# EasyEDA Pro project bldc_board.eprj

# Schematic Dual_Drive_4
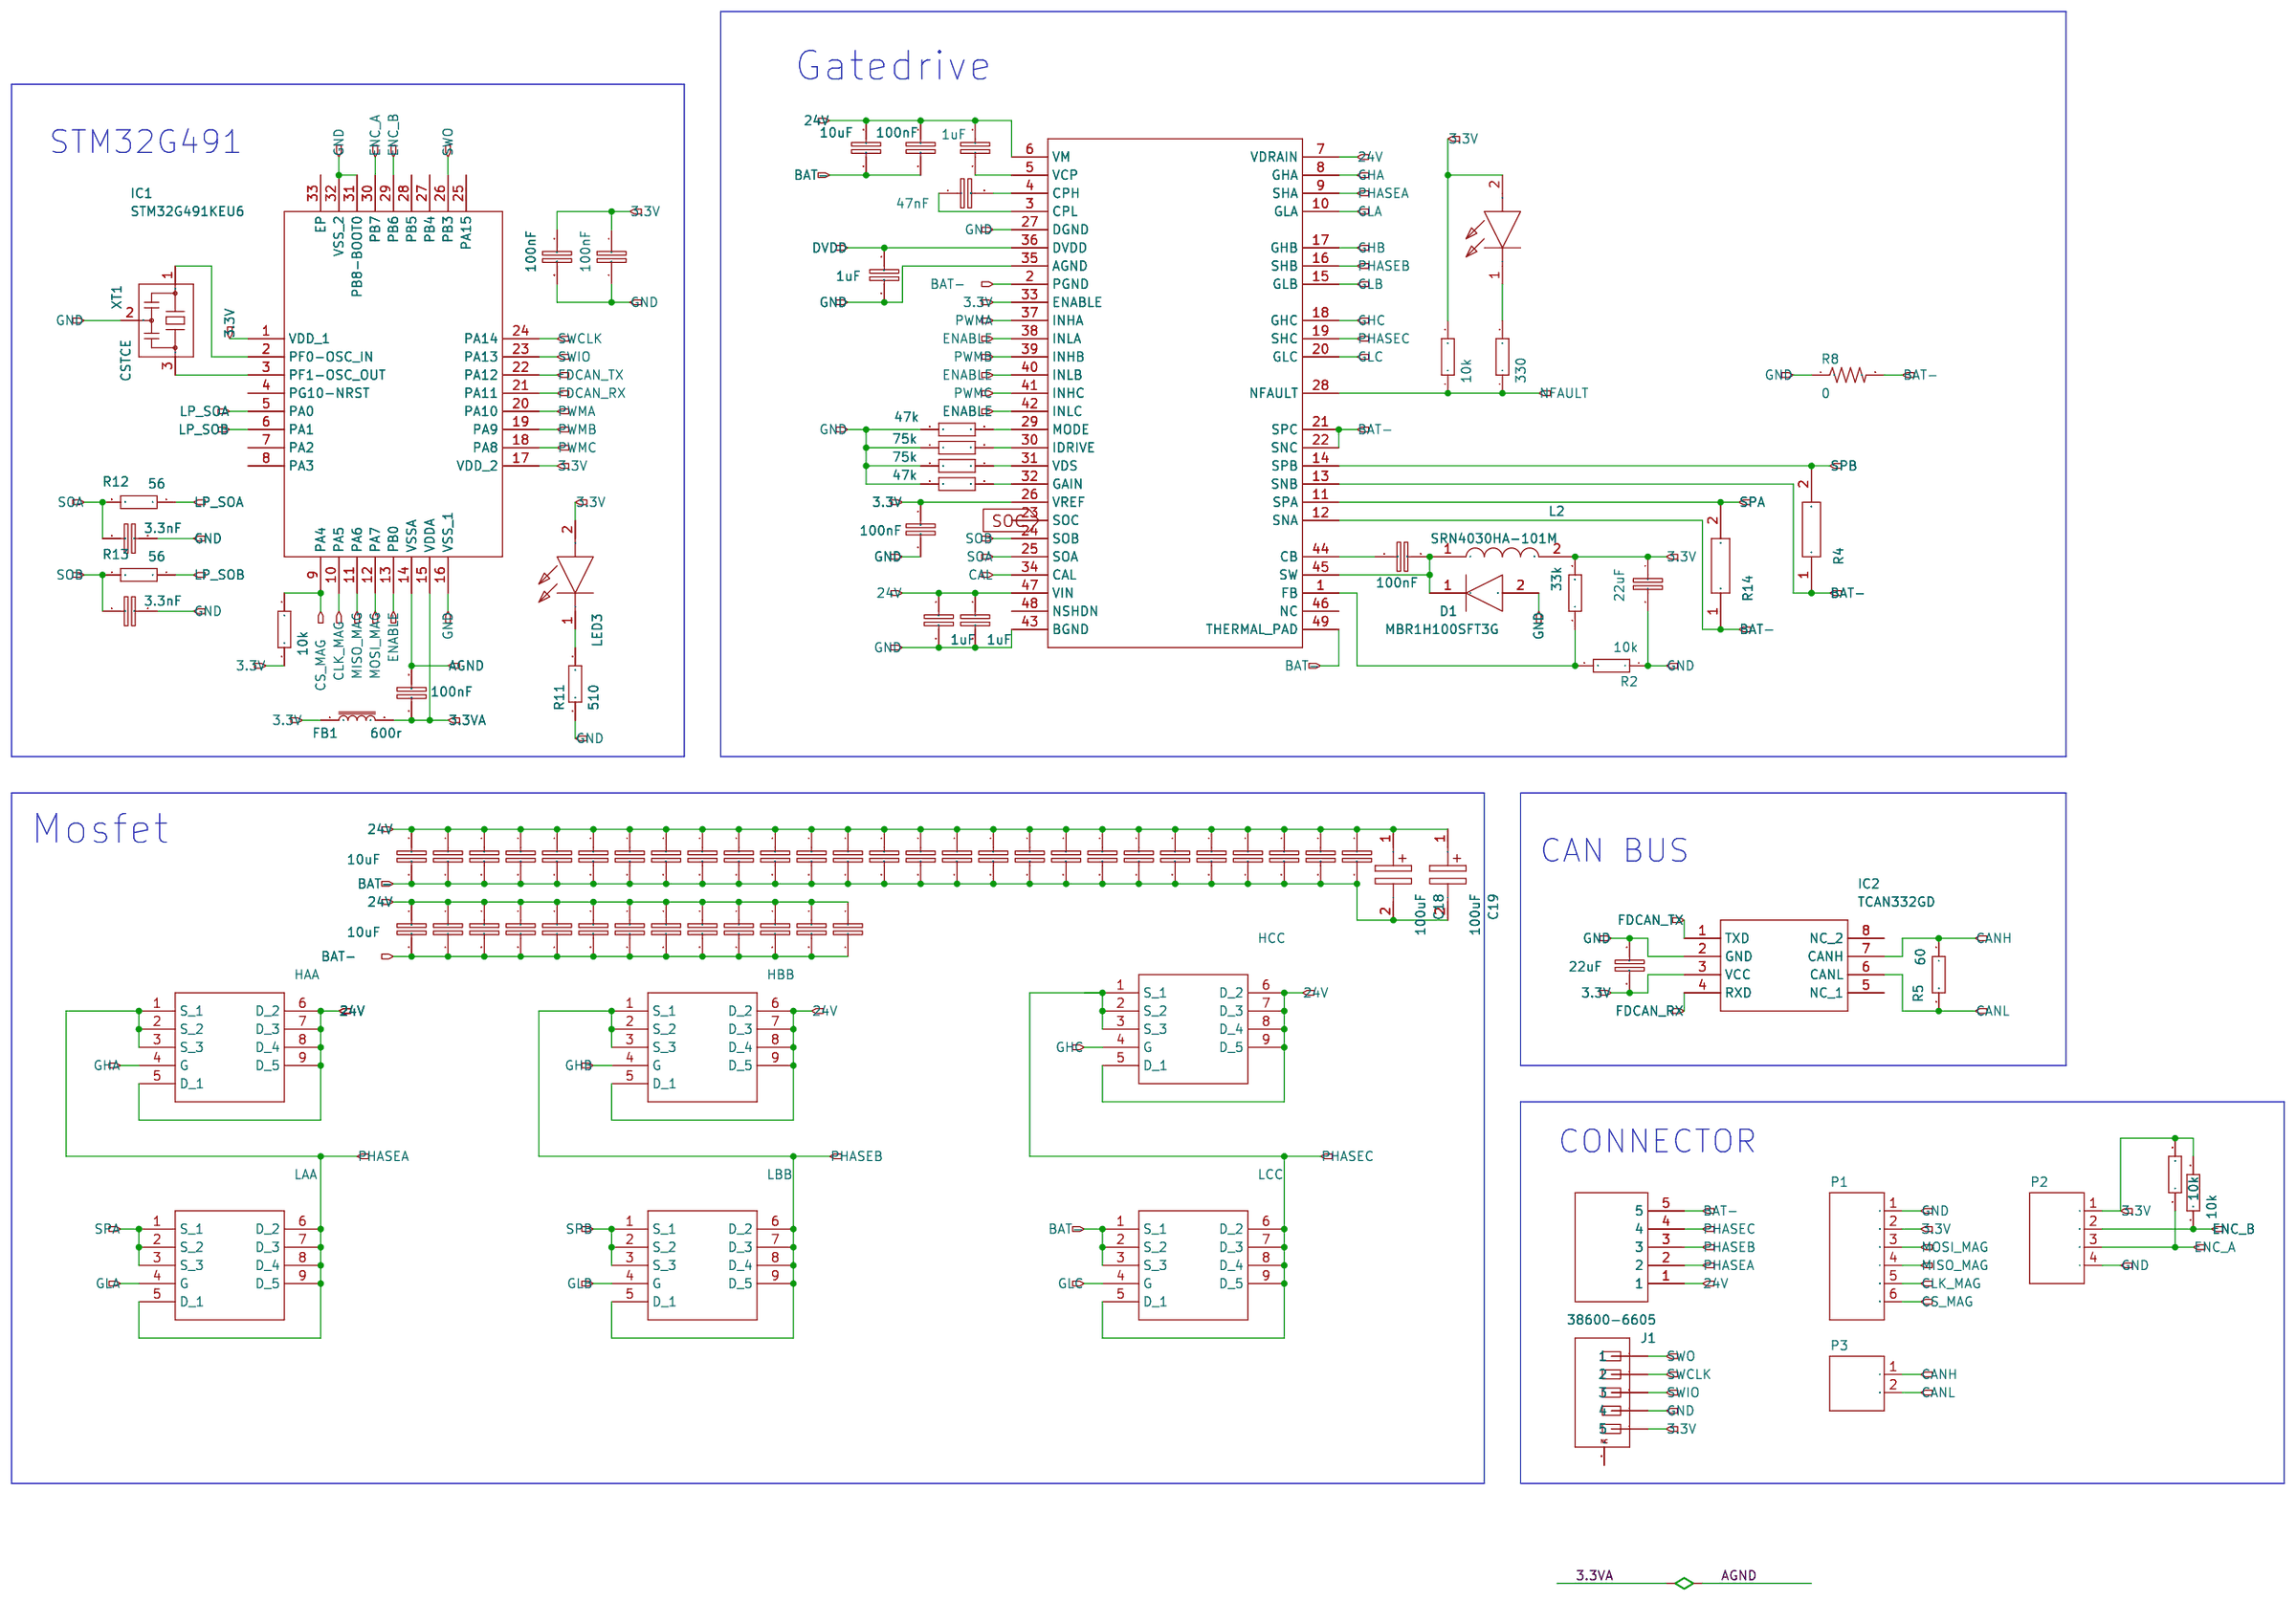
[diagram p0: schematic sheet]

## Parts
C1  3.3nF  [C0603]
C2  3.3nF  [C0603]
C3  10uF  [C1206]
C4  22uF  [C0603]
C5  10uF  [C1206]
C6  10uF  [C1206]
C7  10uF  [C1206]
C8  10uF  [C1206]
C9  10uF  [C1206]
C10  100nF  [C1206]
C11  1uF  [C0603]
C12  10uF  [C1206]
C13  100nF  [C1206]
C14  1uF  [C0603]
C15  100nF  [C1206]
C16  10uF  [C1206]
C17  10uF  [C1206]
C18  100uF  [CAP-SMD_BD6.3-L6.6-W6.6-LS7.6-RD]
C19  100uF  [CAP-SMD_BD6.3-L6.6-W6.6-LS7.6-RD]
C20  10uF  [C1206]
C21  10uF  [C1206]
C22  10uF  [C1206]
C23  10uF  [C1206]
C24  10uF  [C1206]
C25  10uF  [C1206]
C26  100nF  [C1206]
C27  100nF  [C1206]
C28  10uF  [C1206]
C29  10uF  [C1206]
C30  100nF  [C1206]
C31  10uF  [C1206]
C32  10uF  [C1206]
C33  10uF  [C1206]
C34  10uF  [C1206]
C35  10uF  [C1206]
C36  10uF  [C1206]
C37  10uF  [C1206]
C38  10uF  [C1206]
C39  10uF  [C1206]
C40  10uF  [C1206]
C41  10uF  [C1206]
C42  10uF  [C1206]
C43  10uF  [C1206]
C44  10uF  [C1206]
C45  47nF  [C0805]
C46  22uF  [C0603]
C47  10uF  [C1206]
C48  10uF  [C1206]
C49  10uF  [C1206]
C50  10uF  [C1206]
C51  10uF  [C1206]
C52  10uF  [C1206]
C53  10uF  [C1206]
C54  10uF  [C1206]
C55  10uF  [C1206]
C56  10uF  [C1206]
CIN  1uF  [C0603]
CIN1  1uF  [C0603]
D1  MBR1H100SFT3G
FB1  600r
HAA  TPH2R506PL,L1Q
HBB  TPH2R506PL,L1Q
HCC  TPH2R506PL,L1Q
IC1  STM32G491KEU6  [UFQFPN-32_L5.0-W5.0-P0.50-TL-1]
IC2  TCAN332GD
IC3  DRV8323RHRGZR
J1  38600-6605
L2  SRN4030HA-101M
LAA  TPH2R506PL,L1Q
LBB  TPH2R506PL,L1Q
LCC  TPH2R506PL,L1Q
LED1  LTST-C191KRKT
LED3  LTST-C191KRKT
P1  JST-PH6
P2  JST-PH4
P3  JST-PH2
R1  33k
R2  10k
R3  47k
R4  0.01
R5  60
R6  47k
R7  75k
R8  0
R10  75k
R11  510
R12  56
R13  56
R14  0.01
RPULL  10k
RPULL1  330
RPULL2  10k
RPULL3  10k
RPULL4  10k
U$3  CON-JST-PH2.0-5PIN-SMD
XT1  CSTCE

## Library data of the parts
C1 C2 = CC0603KRX7R9BB332: Capacitance: Tolerance:±10% Tolerance:±10% Voltage Rated: Temperature Coefficient:; LCSC Part Name: 3.3nF ±10% 50V; Supplier Part: C107088; Manufacturer: YAGEO(国巨); Supplier Footprint: 0603; JLCPCB Part Class: Extended Part; Datasheet: https://atta.szlcsc.com/upload/public/pdf/source/20180910/C282072_33301C7F631E79921B82A8DAC6BCC5B3.pdf; Supplier: LCSC; Tolerance: ±10%
C3 C5-C9 C12 C16 C17 C20-C25 C28 C29 C31-C44 C47-C56 = C1206X7R106K500NT: Capacitance: Tolerance:±10% Tolerance:±10% Voltage Rated: Temperature Coefficient:; LCSC Part Name: 10uF ±10% 50V; Supplier Part: C729470; Manufacturer: SANYEAR(叁叶源); Supplier Footprint: 1206; JLCPCB Part Class: Extended Part; Datasheet: https://atta.szlcsc.com/upload/public/pdf/source/20200102/C475251_1E30ECAC0E8AE7254982658A02A2D78C.pdf; Supplier: LCSC; Tolerance: ±10%
C4 C46 = CL10A226MQ8NRNE: Capacitance: Tolerance:±20% Tolerance:±20% Voltage Rated: Temperature Coefficient:; LCSC Part Name: 22uF ±20% 6.3V; Supplier Part: C159801; Manufacturer: SAMSUNG(三星); Supplier Footprint: 0603; JLCPCB Part Class: Extended Part; Datasheet: https://atta.szlcsc.com/upload/public/pdf/source/20160218/1457707763339.pdf; Supplier: LCSC; Tolerance: ±20%
C10 C13 C15 C26 C27 C30 = 1206B104K500NT: Capacitance:100nF Tolerance:±10% Tolerance:±10% Voltage Rated: Temperature Coefficient:; LCSC Part Name: 100nF ±10% 50V; Supplier Part: C110253; Manufacturer: FH(风华); Supplier Footprint: 1206; JLCPCB Part Class: Extended Part; Datasheet: https://atta.szlcsc.com/upload/public/pdf/source/20200305/C486355_26A10D38EF8C2A5C37091D0039909270.pdf; Supplier: LCSC; Tolerance: ±10%
C11 C14 CIN CIN1 = CC0603KRX7R9BB105: Capacitance: Tolerance:±10% Tolerance:±10% Voltage Rated: Temperature Coefficient:; LCSC Part Name: 1uF ±10% 50V; Supplier Part: C559769; Manufacturer: YAGEO(国巨); Supplier Footprint: 0603; JLCPCB Part Class: Extended Part; Datasheet: https://atta.szlcsc.com/upload/public/pdf/source/20181031/C325451_C7CF01155AE3010E0D610C52F5FE7D31.pdf; Supplier: LCSC; Tolerance: ±10%
C18 C19 = RVT1H101M0607: Capacitance: Tolerance:±20% Tolerance:±20% Rated Voltage: Ripple Current:229mA@120Hz φD: L: Lifetime @ Temp: Operating Temperature:-40℃~+105℃ Operating Temperature:-40℃~+105℃; LCSC Part Name: 100uF ±20% 50V; Supplier Part: C3151829; Manufacturer: ROQANG(容强); Supplier Footprint: SMD,D6.3xL7.7mm; JLCPCB Part Class: Extended Part; Datasheet: https://atta.szlcsc.com/upload/public/pdf/source/20170325/1490427950282.pdf; Supplier: LCSC; Tolerance: ±20%; Ripple Current: 229mA@120Hz; Lifetime @ Temp: 2000hrs@105℃; Operating Temperature: -40℃~+105℃
C45 = 0805B473K500NT: Capacitance:47nF Tolerance:±10% Tolerance:±10% Voltage Rated: Temperature Coefficient:; LCSC Part Name: 47nF ±10% 50V; Supplier Part: C1745; Manufacturer: FH(风华); Supplier Footprint: 0805; JLCPCB Part Class: Extended Part; Datasheet: https://atta.szlcsc.com/upload/public/pdf/source/20200305/C486355_26A10D38EF8C2A5C37091D0039909270.pdf; Supplier: LCSC; Tolerance: ±10%
D1 = MBR1H100SFT3G_MBR1H100SFT3G_
FB1 = SparkFun-Coils_FERRITE_BEAD_-0603
HAA HBB HCC LAA LBB LCC = TPH2R506PL_L1Q_TPH2R506PL,L1Q_
IC1 = STM32G491KEU6: CPU Core:- Program Storage Size:512KB GPIO Ports Number:26 Operating Voltage Range:1.71V~3.6V Operating Voltage Range:1.71V~3.6V CPU Maximum Speed:170MHz Operating Temperature Range:-40℃~+85℃ Operating Temperature Range:-40℃~+85℃ ADC (Bit):12bit DAC (Bit); Supplier Part: C3225629; Manufacturer: ST(意法半导体); Supplier Footprint: UFQFPN-32(5x5); JLCPCB Part Class: Extended Part; Datasheet: https://atta.szlcsc.com/upload/public/pdf/source/20221107/0005850207A0EC94E09E1AFE17A81C39.pdf; Supplier: LCSC; Program Storage Size: 512KB; GPIO Ports Number: 26; Operating Voltage Range: 1.71V~3.6V; CPU Maximum Speed: 170MHz; Operating Temperature Range: -40℃~+85℃; ADC (Bit): 12bit; DAC (Bit): 12bit; Universal Serial Bus: 有; Watchdog: 有; Infrared Data Association: 有; Low-Voltage Detect: 有; Direct Memory Access: 有; Internal Oscillator: 有
IC2 = TCAN332GD_TCAN332GD_
IC3 = projectieie_DRV8323RHRGZR_
J1 = 38600-6605_38600-6605_
L2 = SRN4030HA-101M_SRN4030HA-101M_
LED1 LED3 = LTST-C191KRKT_LTST-C191KRKT_
P1 = jst-ph_JST-PH6_
P2 = jst-ph_JST-PH4_
P3 = jst-ph_JST-PH2_
R1 R2 RPULL RPULL1-RPULL4 = projectieie_R-EU__R0603
R3 R5-R7 R10-R13 = rcl_R-EU__R0603
R4 R14 = CRA2512-FZ-R010ELF_CRA2512-FZ-R010ELF_
R8 = rcl_R-US__M1206
U$3 = con-jst-ph2.0_CON-JST-PH2.0-5PIN-SMD_
XT1 = sc_usercreated_CSTCE_

## Nets
3.3V: C4.2 C15.1 C26.1 C27.1 C46.1 FB1.1 IC1.1(VDD) IC1.17(VDD_2) IC2.3(VCC) IC3.26(VREF) IC3.33(ENABLE) L2.2 LED1.2(A) LED3.2(A) P1.2 P2.1 R1.2 RPULL.2 RPULL2.1 RPULL3.2 RPULL4.2 U$3.5
3.3VA: C30.1 C30.2 FB1.2 IC1.14(VSSA) IC1.15(VDDA)
24V: C3.1 C5.1 C6.1 C7.1 C8.1 C9.1 C10.1 C11.1 C12.1 C16.1 C17.1 C18.1(+) C19.1(+) C20.1 C21.1 C22.1 C23.1 C24.1 C25.1 C28.1 C29.1 C31.1 C32.1 C33.1 C34.1 C35.1 C36.1 C37.1 C38.1 C39.1 C40.1 C41.1 C42.1 C43.1 C44.1 C47.1 C48.1 C49.1 C50.1 C51.1 C52.1 C53.1 C54.1 C55.1 C56.1 CIN.1 CIN1.1 HAA.5(D_1) HAA.6(D_2) HAA.7(D_3) HAA.8(D_4) HAA.9(D_5) HBB.5(D_1) HBB.6(D_2) HBB.7(D_3) HBB.8(D_4) HBB.9(D_5) HCC.5(D_1) HCC.6(D_2) HCC.7(D_3) HCC.8(D_4) HCC.9(D_5) IC3.6(VM) IC3.7(VDRAIN) IC3.47(VIN) J1.1
DVDD: C14.1 IC3.36(DVDD)
GND: C1.2 C2.2 C4.1 C14.2 C15.2 C26.2 C27.2 C46.2 CIN.2 CIN1.2 D1.2(A) IC1.16(VSS_1) IC1.31(PB8-BOOT0) IC1.32(VSS_2) IC2.2(GND) IC3.27(DGND) IC3.35(AGND) IC3.43(BGND) P1.1 P2.4 R2.1 R3.1 R6.1 R7.1 R8.1 R10.1 R11.1 U$3.4 XT1.2
BAT-: C3.2 C5.2 C6.2 C7.2 C8.2 C9.2 C10.2 C12.2 C16.2 C17.2 C18.2(-) C19.2(-) C20.2 C21.2 C22.2 C23.2 C24.2 C25.2 C28.2 C29.2 C31.2 C32.2 C33.2 C34.2 C35.2 C36.2 C37.2 C38.2 C39.2 C40.2 C41.2 C42.2 C43.2 C44.2 C47.2 C48.2 C49.2 C50.2 C51.2 C52.2 C53.2 C54.2 C55.2 C56.2 IC3.2(PGND) IC3.12(SNA) IC3.13(SNB) IC3.21(SPC) IC3.22(SNC) IC3.49(THERMAL_PAD) J1.5 LCC.1(S) LCC.2(S) LCC.3(S) R4.1 R8.2 R14.1
CAL: IC3.34(CAL)
CANH: IC2.7(CANH) P3.1 R5.1
CANL: IC2.6(CANL) P3.2 R5.2
CB: C13.1 IC3.44(CB)
CLK_MAG: IC1.10(PA5) P1.5
CPH: C45.2 IC3.4(CPH)
CPL: C45.1 IC3.3(CPL)
CS_MAG: IC1.9(PA4) P1.6 RPULL2.2
ENABLE: IC1.13(PB0) IC3.38(INLA) IC3.40(INLB) IC3.42(INLC)
ENC_A: IC1.30(PB7) P2.3 RPULL4.1
ENC_B: IC1.29(PB6) P2.2 RPULL3.1
FB: IC3.1(FB) R1.1 R2.2
FDCAN_RX: IC1.21(PA11) IC2.4(RXD)
FDCAN_TX: IC1.22(PA12) IC2.1(TXD)
GAIN: IC3.32(GAIN) R3.2
GHA: HAA.4(G) IC3.8(GHA)
GHB: HBB.4(G) IC3.17(GHB)
GHC: HCC.4(G) IC3.18(GHC)
GLA: IC3.10(GLA) LAA.4(G)
GLB: IC3.15(GLB) LBB.4(G)
GLC: IC3.20(GLC) LCC.4(G)
IDRIVE: IC3.30(IDRIVE) R7.2
LEDFAULT: LED1.1(K) RPULL1.2
LP_SOA: IC1.5(PA0) R12.1
LP_SOB: IC1.6(PA1) R13.1
MISO_MAG: IC1.11(PA6) P1.4
MODE: IC3.29(MODE) R6.2
MOSI_MAG: IC1.12(PA7) P1.3
N$9: IC1.3(PF1-OSC_OUT) XT1.3
N$10: LED3.1(K) R11.2
N$11: IC1.2(PF0-OSC_IN) XT1.1
NFAULT: IC3.28(NFAULT) RPULL.1 RPULL1.1
PHASEA: HAA.1(S) HAA.2(S) HAA.3(S) IC3.9(SHA) J1.2 LAA.5(D_1) LAA.6(D_2) LAA.7(D_3) LAA.8(D_4) LAA.9(D_5)
PHASEB: HBB.1(S) HBB.2(S) HBB.3(S) IC3.16(SHB) J1.3 LBB.5(D_1) LBB.6(D_2) LBB.7(D_3) LBB.8(D_4) LBB.9(D_5)
PHASEC: HCC.1(S) HCC.2(S) HCC.3(S) IC3.19(SHC) J1.4 LCC.5(D_1) LCC.6(D_2) LCC.7(D_3) LCC.8(D_4) LCC.9(D_5)
PWMA: IC1.20(PA10) IC3.37(INHA)
PWMB: IC1.19(PA9) IC3.39(INHB)
PWMC: IC1.18(PA8) IC3.41(INHC)
SOA: C1.1 IC3.25(SOA) R12.2
SOB: C2.1 IC3.24(SOB) R13.2
SOC: IC3.23(SOC)
SPA: IC3.11(SPA) LAA.1(S) LAA.2(S) LAA.3(S) R14.2
SPB: IC3.14(SPB) LBB.1(S) LBB.2(S) LBB.3(S) R4.2
SW: C13.2 D1.1(K) IC3.45(SW) L2.1
SWCLK: IC1.24(PA14) U$3.2
SWIO: IC1.23(PA13) U$3.3
SWO: IC1.26(PB3) U$3.1
VCP: C11.2 IC3.5(VCP)
VDS: IC3.31(VDS) R10.2

Not connected (* = marked no-connect by the designer): IC1 4(PG10-NRST) 7(PA2) 8(PA3) 25(PA15) 27(PB4) 28(PB5) 33(EP); IC2 5(NC_1) 8(NC_2); IC3 46(NC) 48(NSHDN); U$3 NC1*2(NC)

## Notes on the sheet
- Gatedrive
- STM32G491
- Mosfet
- CAN BUS
- CONNECTOR

# Board Dual_Drive_4
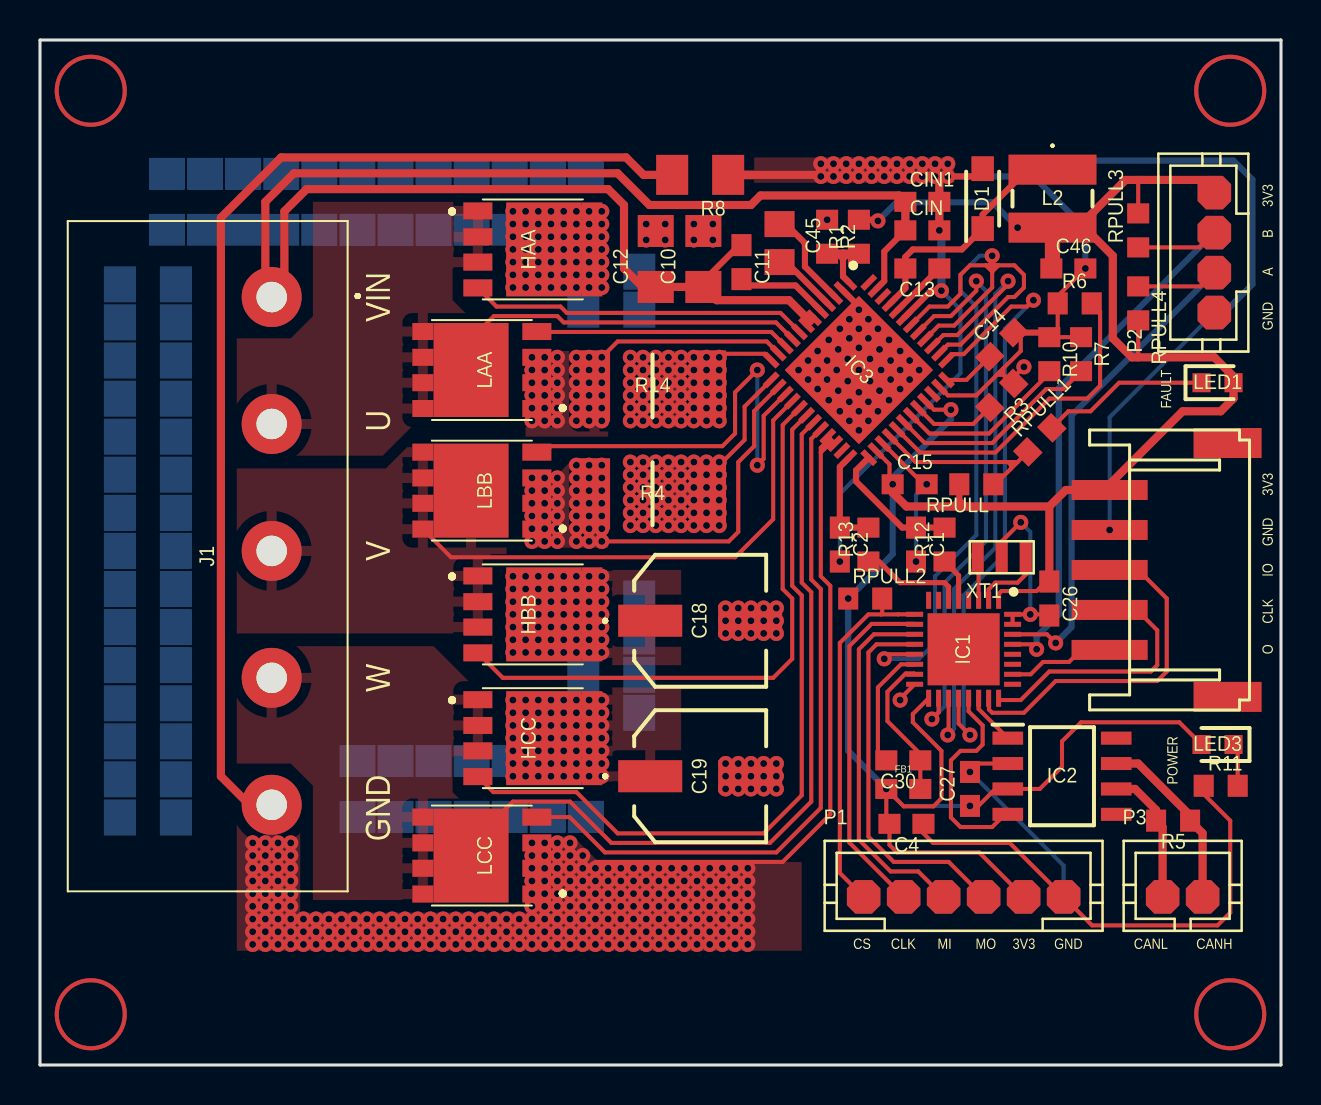
[diagram p1: board, top side]
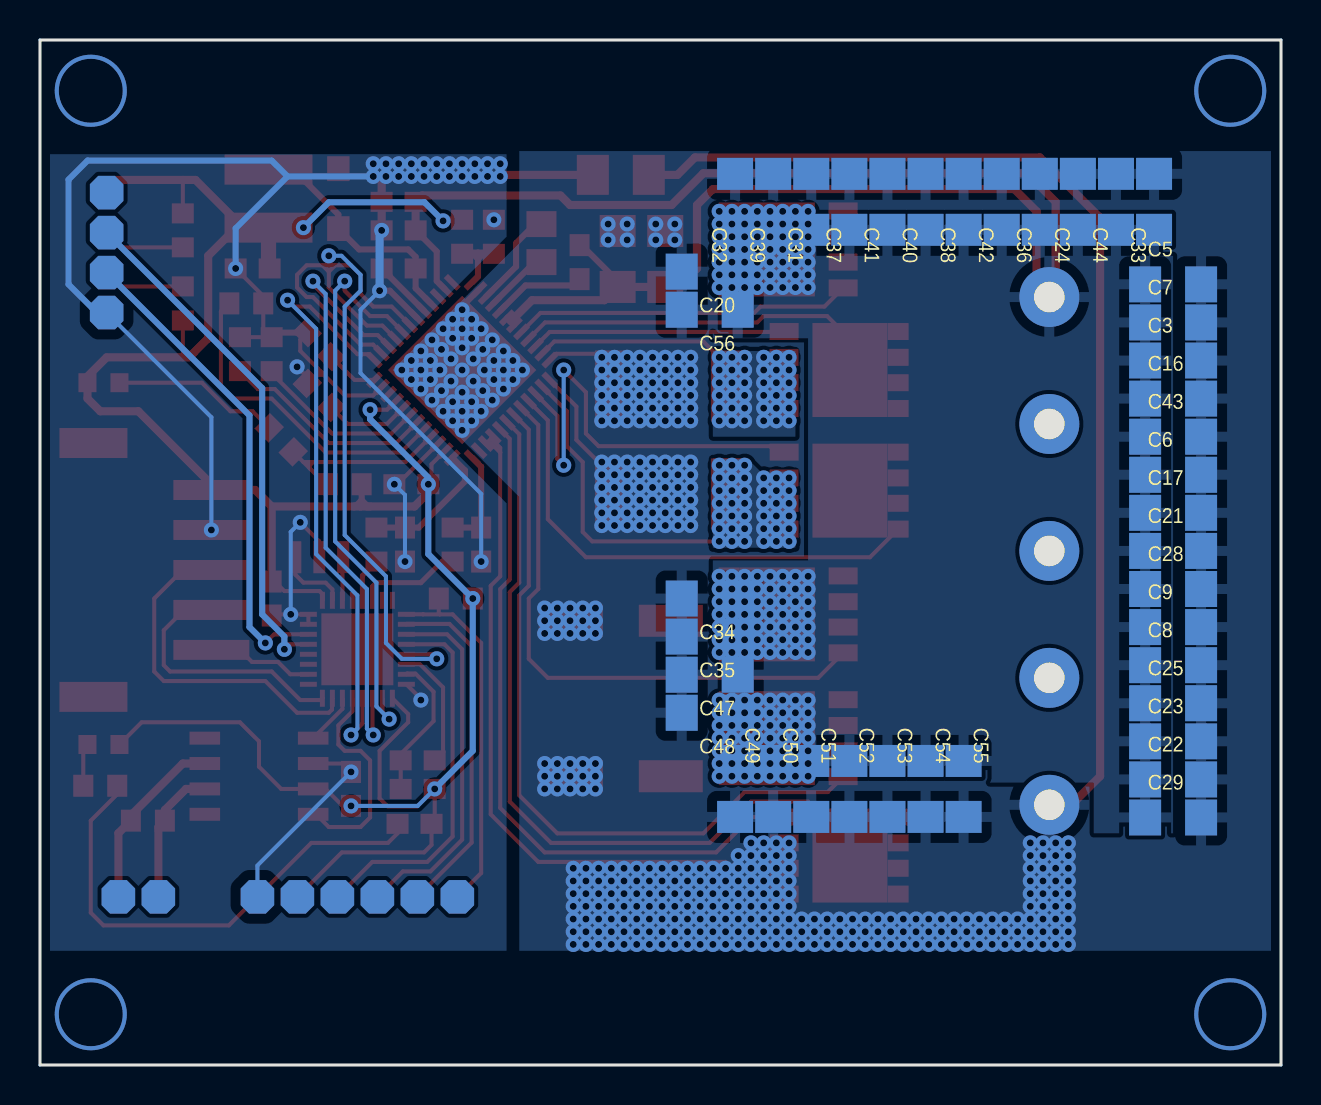
[diagram p2: board, bottom side, seen from below]

Outline 62.07 x 51.28 mm; copper layers: Top Layer, Bottom Layer. Coordinates in mm from the lower left corner of the outline.
Outline path: 0,51.28 62.07,51.28 62.07,0 0,0 0,51.28
Stack: Top Layer 0.035mm / Dielectric1 1.51mm FR4 er 4.5 / Bottom Layer 0.035mm

## Design rules (mm)
spacing safeClearance (default): track to track 0.152, other pairs 0 to 0.152
track width trackWidth (default): min 0.003, default 0.003, max 2.54
differential pair differentialPair (default): width min 0.127, default 0.254, max 2.54; gap min 0.152, default 0.152
via viaSize (default): diameter min 0, default 0, max 2.6; hole min 0, default 0, max 2
net GND uses CopperRegion1
net 24V uses CopperRegion4
net PHASEA uses CopperRegion5
net SPA uses CopperRegion7
net SPB uses CopperRegion9
net PHASEB uses CopperRegion10
net PHASEC uses CopperRegion11
net BAT- uses CopperRegion15
pour ie117 uses CopperRegion
pour ie118 uses CopperRegion1
pour ie419 uses CopperRegion2
pour ie420 uses CopperRegion3
pour ie421 uses CopperRegion4
pour ie451 uses CopperRegion5
pour ie458 uses CopperRegion6
pour ie459 uses CopperRegion7
pour ie507 uses CopperRegion8
pour ie508 uses CopperRegion9
pour ie554 uses CopperRegion10
pour ie560 uses CopperRegion11
pour ie1020 uses CopperRegion12
pour ie1021 uses CopperRegion13
pour ie1022 uses CopperRegion14
pour ie1023 uses CopperRegion15

## Placement (name value [footprint] x y rotation side)
C1  3.3nF  [C0603]  43.81 26.03 270 top
C2  3.3nF  [C0603]  40 26.03 270 top
C3  10uF  [C1206]  5.4 35.24 180 bottom
C4  22uF  [C0603]  43.34 12.06 180 top
C5  10uF  [C1206]  5.4 39.05 180 bottom
C6  10uF  [C1206]  5.4 29.53 180 bottom
C7  10uF  [C1206]  5.4 37.15 180 bottom
C8  10uF  [C1206]  5.4 20 180 bottom
C9  10uF  [C1206]  5.4 21.91 180 bottom
C10  0.1uF  [C1206]  33.18 40.32 90 top
C11  1uF  [C0603]  35.08 40.16 270 top
C12  10uF  [C1206]  30.8 40.32 90 top
C13  0.1uF  [C0603]  44.13 39.85 180 top
C14  1uF  [C0603]  48.1 36.04 45 top
C15  0.1uF  [C0603]  43.5 29.05 0 top
C16  10uF  [C1206]  5.4 33.34 180 bottom
C17  10uF  [C1206]  5.4 27.62 180 bottom
C18  EEE-FTH101XAL  [EEEHP1H4R7P]  33.02 22.22 270 top
C19  EEE-FTH101XAL  [EEEHP1H4R7P]  33.02 14.45 270 top
C20  10uF  [C1206]  28.57 39.69 0 bottom
C21  10uF  [C1206]  5.4 25.72 180 bottom
C22  10uF  [C1206]  5.4 14.29 180 bottom
C23  10uF  [C1206]  5.4 16.19 180 bottom
C24  10uF  [C1206]  10.16 43.18 90 bottom
C25  10uF  [C1206]  5.4 18.1 180 bottom
C26  0.1uF  [C0603]  50.48 23.34 270 top
C27  0.1uF  [C0603]  46.51 13.81 90 top
C28  10uF  [C1206]  5.4 23.81 180 bottom
C29  10uF  [C1206]  5.4 12.38 180 bottom
C30  0.1uF  [C0603]  43.18 15.24 180 top
C31  10uF  [C1206]  23.5 43.18 90 bottom
C32  10uF  [C1206]  27.31 43.18 90 bottom
C33  10uF  [C1206]  6.35 43.18 90 bottom
C34  10uF  [C1206]  28.57 23.34 0 bottom
C35  10uF  [C1206]  28.57 21.43 0 bottom
C36  10uF  [C1206]  12.06 43.18 90 bottom
C37  10uF  [C1206]  21.59 43.18 90 bottom
C38  10uF  [C1206]  15.88 43.18 90 bottom
C39  10uF  [C1206]  25.4 43.18 90 bottom
C40  10uF  [C1206]  17.78 43.18 90 bottom
C41  10uF  [C1206]  19.69 43.18 90 bottom
C42  10uF  [C1206]  13.97 43.18 90 bottom
C43  10uF  [C1206]  5.4 31.43 180 bottom
C44  10uF  [C1206]  8.25 43.18 90 bottom
C45  47nF  [C0805]  36.99 41.12 270 top
C46  22uF  [C0603]  51.44 39.85 0 top
C47  10uF  [C1206]  28.57 19.53 0 bottom
C48  10uF  [C1206]  28.57 17.62 0 bottom
C49  10uF  [C1206]  27.31 13.81 270 bottom
C50  10uF  [C1206]  25.4 13.81 270 bottom
C51  10uF  [C1206]  23.5 13.81 270 bottom
C52  10uF  [C1206]  21.59 13.81 270 bottom
C53  10uF  [C1206]  19.69 13.81 270 bottom
C54  10uF  [C1206]  17.78 13.81 270 bottom
C55  10uF  [C1206]  15.88 13.81 270 bottom
C56  10uF  [C1206]  28.57 37.78 0 bottom
CIN  1uF  [C0603]  44.13 41.75 0 top
CIN1  1uF  [C0603]  44.13 43.18 0 top
D1  MBR1H100SFT3G  [SODFL3616X98N]  47.15 43.34 90 top
FB1  600r  [0603]  43.18 13.81 0 top
HAA  TPH2R506PL,L1Q  [TPHR9003NLL1Q]  24.21 40.8 270 top
HBB  TPH2R506PL,L1Q  [TPHR9003NLL1Q]  24.21 22.54 270 top
HCC  TPH2R506PL,L1Q  [TPHR9003NLL1Q]  24.21 16.35 270 top
IC1  STM32G491KEU6  [QFN50P500X500X60-33N]  46.2 20.8 270 top
IC2  TCAN332GD  [SOIC127P600X175-8N]  51.12 14.45 0 top
IC3  DRV8323RHRGZR  [QFN50P700X700X100-49N]  40.96 34.77 315 top
J1  38600-6605  [386006605]  11.59 38.42 270 top
L2  SRN4030HA-101M  [SRN4030HA101M]  50.64 43.34 180 top
LAA  TPH2R506PL,L1Q  [TPHR9003NLL1Q]  22.54 34.77 90 top
LBB  TPH2R506PL,L1Q  [TPHR9003NLL1Q]  22.54 28.73 90 top
LCC  TPH2R506PL,L1Q  [TPHR9003NLL1Q]  22.54 10.48 90 top
LED1  LTST-C191KRKT  [LEDC1608X55N]  58.9 34.13 0 top
LED3  LTST-C191KRKT  [LEDC1608X55N]  58.9 16.03 180 top
P1  -  [JST-PH6]  46.2 8.41 0 top
P2  -  [JST-PH4]  58.74 40.64 90 top
P3  -  [JST-PH2]  57.15 8.41 0 top
R1  33k  [R0603]  40.96 41.43 90 top
R2  10k  [R0603]  39.37 41.43 270 top
R3  47k  [R0603]  48.1 33.5 225 top
R4  0.01  [RESC6434X90N]  30.64 28.57 180 top
R5  60  [R0603]  56.67 12.22 180 top
R6  47k  [R0603]  51.75 38.1 0 top
R7  75k  [R0603]  52.07 35.56 270 top
R8  0  [M1206]  33.02 44.53 180 top
R10  75k  [R0603]  50.48 35.56 270 top
R11  510  [R0603]  59.06 13.97 0 top
R12  56  [R0603]  45.24 26.03 90 top
R13  56  [R0603]  41.43 26.03 90 top
R14  0.01  [RESC6434X90N]  30.64 33.97 180 top
RPULL  10k  [R0603]  46.83 29.05 180 top
RPULL1  330  [R0603]  50.01 31.27 45 top
RPULL2  10k  [R0603]  41.28 23.34 0 top
RPULL3  10k  [R0603]  54.93 41.75 90 top
RPULL4  10k  [R0603]  54.93 38.1 270 top
U$3  -  [CON-JST-PH2.0-5PIN-SMD]  53.5 24.76 270 top
XT1  -  [CSTCE]  48.1 25.4 180 top

## Footprints (pads in the part's own frame, mm; a bottom-side part is the same pattern mirrored in y, then rotated)
0603
  rect 1.1x1 smd: 1(-0.85,0) 2(0.85,0)
386006605
  round 3 hole 1.524: 1(0,0) 2(6.35,0) 3(12.7,0) 4(19.05,0) 5(25.4,0)
C0603
  rect 1.1x1 smd: 1(-0.85,0) 2(0.85,0)
C0805
  rect 1.3x1.5 smd: 1(-0.95,0) 2(0.95,0)
C1206
  rect 1.6x1.8 smd: 1(-1.4,0) 2(1.4,0)
CON-JST-PH2.0-5PIN-SMD
  rect 1x3.8 smd: 1(4,0) 2(2,0) 3(0,0) 4(-2,0) 5(-4,0)
  rect 1.5x3.4 smd: NC1(-6.35,5.9) NC2(6.35,5.9)
CSTCE
  rect 0.6x1.6 smd: 1(-1.2,0) 2(0,0) 3(1.2,0)
EEEHP1H4R7P
  rect 1.6x3.2 smd: 1(0,-2.5) 2(0,2.5)
JST-PH2
  custom 1.676x1.676 hole 0.813: 1(1,0) 2(-1,0)
JST-PH4
  custom 1.676x1.676 hole 0.813: 1(3,0) 2(1,0) 3(-1,0) 4(-3,0)
JST-PH6
  custom 1.676x1.676 hole 0.813: 1(5,0) 2(3,0) 3(1,0) 4(-1,0) 5(-3,0) 6(-5,0)
LEDC1608X55N
  rect 0.9x0.95 smd: 1(-0.8,0) 2(0.8,0)
M1206
  rect 1.6x2 smd: 1(-1.4,0) 2(1.4,0)
QFN50P500X500X60-33N
  rect 0.85x0.25 smd: 1(-2.45,1.75) 2(-2.45,1.25) 3(-2.45,0.75) 4(-2.45,0.25) 5(-2.45,-0.25) 6(-2.45,-0.75) 7(-2.45,-1.25) 8(-2.45,-1.75) 17(2.45,-1.75) 18(2.45,-1.25) 19(2.45,-0.75) 20(2.45,-0.25) 21(2.45,0.25) 22(2.45,0.75) 23(2.45,1.25) 24(2.45,1.75)
  rect 0.25x0.85 smd: 9(-1.75,-2.45) 10(-1.25,-2.45) 11(-0.75,-2.45) 12(-0.25,-2.45) 13(0.25,-2.45) 14(0.75,-2.45) 15(1.25,-2.45) 16(1.75,-2.45) 25(1.75,2.45) 26(1.25,2.45) 27(0.75,2.45) 28(0.25,2.45) 29(-0.25,2.45) 30(-0.75,2.45) 31(-1.25,2.45) 32(-1.75,2.45)
  rect 3.6x3.6 smd: 33(0,0)
QFN50P700X700X100-49N
  rect 0.9x0.3 smd: 1(-3.45,2.75) 2(-3.45,2.25) 3(-3.45,1.75) 4(-3.45,1.25) 5(-3.45,0.75) 6(-3.45,0.25) 7(-3.45,-0.25) 8(-3.45,-0.75) 9(-3.45,-1.25) 10(-3.45,-1.75) 11(-3.45,-2.25) 12(-3.45,-2.75) 25(3.45,-2.75) 26(3.45,-2.25) 27(3.45,-1.75) 28(3.45,-1.25) 29(3.45,-0.75) 30(3.45,-0.25) 31(3.45,0.25) 32(3.45,0.75) 33(3.45,1.25) 34(3.45,1.75) 35(3.45,2.25) 36(3.45,2.75)
  rect 0.3x0.9 smd: 13(-2.75,-3.45) 14(-2.25,-3.45) 15(-1.75,-3.45) 16(-1.25,-3.45) 17(-0.75,-3.45) 18(-0.25,-3.45) 19(0.25,-3.45) 20(0.75,-3.45) 21(1.25,-3.45) 22(1.75,-3.45) 23(2.25,-3.45) 24(2.75,-3.45) 37(2.75,3.45) 38(2.25,3.45) 39(1.75,3.45) 40(1.25,3.45) 41(0.75,3.45) 42(0.25,3.45) 43(-0.25,3.45) 44(-0.75,3.45) 45(-1.25,3.45) 46(-1.75,3.45) 47(-2.25,3.45) 48(-2.75,3.45)
  rect 5.25x5.25 smd: 49(0,0)
R0603
  rect 1x1.1 smd: 1(-0.85,0) 2(0.85,0)
RESC6434X90N
  rect 1.55x3.55 smd: 1(-2.9,0) 2(2.9,0)
SODFL3616X98N
  rect 1.24x1.12 smd: 1(-1.5,0) 2(1.5,0)
SOIC127P600X175-8N
  rect 1.528x0.65 smd: 1(-2.711,1.905) 2(-2.711,0.635) 3(-2.711,-0.635) 4(-2.711,-1.905) 5(2.711,-1.905) 6(2.711,-0.635) 7(2.711,0.635) 8(2.711,1.905)
SRN4030HA101M
  rect 4.4x1.5 smd: 1(0,-1.45) 2(0,1.45)
TPHR9003NLL1Q
  rect 0.85x1.45 smd: 1(-1.925,-2.309) 2(-0.635,-2.309) 3(0.635,-2.309) 4(1.925,-2.309)
  rect 0.85x1.05 smd: 5(1.925,3.391) 6(0.635,3.391) 7(-0.635,3.391) 8(-1.925,3.391)
  rect 4.7x3.75 smd: 9(0,0.981)

## Nets
3.3V: C4.2 C15.1 C26.1 C27.1 C46.1 FB1.1 IC1.1 IC1.17 IC2.3 IC3.26 IC3.33 L2.2 LED1.2 LED3.2 P1.2 P2.1 R1.2 RPULL.2 RPULL2.1 RPULL3.2 RPULL4.2 U$3.5
3.3VA: C30.1 FB1.2 IC1.15
24V: C3.1 C5.1 C6.1 C7.1 C8.1 C9.1 C10.1 C11.1 C12.1 C16.1 C17.1 C18.1 C19.1 C20.1 C21.1 C22.1 C23.1 C24.1 C25.1 C28.1 C29.1 C31.1 C32.1 C33.1 C34.1 C35.1 C36.1 C37.1 C38.1 C39.1 C40.1 C41.1 C42.1 C43.1 C44.1 C47.1 C48.1 C49.1 C50.1 C51.1 C52.1 C53.1 C54.1 C55.1 C56.1 CIN.1 CIN1.1 HAA.5 HAA.6 HAA.7 HAA.8 HAA.9 HBB.5 HBB.6 HBB.7 HBB.8 HBB.9 HCC.5 HCC.6 HCC.7 HCC.8 HCC.9 IC3.6 IC3.7 IC3.47 J1.1
AGND: C30.2 IC1.14
DVDD: C14.1 IC3.36
GND: C1.2 C2.2 C4.1 C14.2 C15.2 C26.2 C27.2 C46.2 CIN.2 CIN1.2 D1.2 IC1.16 IC1.31 IC1.32 IC2.2 IC3.27 IC3.35 IC3.43 P1.1 P2.4 R2.1 R3.1 R6.1 R7.1 R8.1 R10.1 R11.1 U$3.4 XT1.2
BAT-: C3.2 C5.2 C6.2 C7.2 C8.2 C9.2 C10.2 C12.2 C16.2 C17.2 C18.2 C19.2 C20.2 C21.2 C22.2 C23.2 C24.2 C25.2 C28.2 C29.2 C31.2 C32.2 C33.2 C34.2 C35.2 C36.2 C37.2 C38.2 C39.2 C40.2 C41.2 C42.2 C43.2 C44.2 C47.2 C48.2 C49.2 C50.2 C51.2 C52.2 C53.2 C54.2 C55.2 C56.2 IC3.2 IC3.12 IC3.13 IC3.21 IC3.22 IC3.49 J1.5 LCC.1 LCC.2 LCC.3 R4.1 R8.2 R14.1
CAL: IC3.34
CANH: IC2.7 P3.1 R5.1
CANL: IC2.6 P3.2 R5.2
CB: C13.1 IC3.44
CLK_MAG: IC1.10 P1.5
CPH: C45.2 IC3.4
CPL: C45.1 IC3.3
CS_MAG: IC1.9 P1.6 RPULL2.2
ENABLE: IC1.13 IC3.38 IC3.40 IC3.42
ENC_A: IC1.30 P2.3 RPULL4.1
ENC_B: IC1.29 P2.2 RPULL3.1
FB: IC3.1 R1.1 R2.2
FDCAN_RX: IC1.21 IC2.4
FDCAN_TX: IC1.22 IC2.1
GAIN: IC3.32 R3.2
GHA: HAA.4 IC3.8
GHB: HBB.4 IC3.17
GHC: HCC.4 IC3.18
GLA: IC3.10 LAA.4
GLB: IC3.15 LBB.4
GLC: IC3.20 LCC.4
IDRIVE: IC3.30 R7.2
LEDFAULT: LED1.1 RPULL1.2
LP_SOA: IC1.5 R12.1
LP_SOB: IC1.6 R13.1
MISO_MAG: IC1.11 P1.4
MODE: IC3.29 R6.2
MOSI_MAG: IC1.12 P1.3
N$9: IC1.3 XT1.3
N$10: LED3.1 R11.2
N$11: IC1.2 XT1.1
NFAULT: IC3.28 RPULL.1 RPULL1.1
PHASEA: HAA.1 HAA.2 HAA.3 IC3.9 J1.2 LAA.5 LAA.6 LAA.7 LAA.8 LAA.9
PHASEB: HBB.1 HBB.2 HBB.3 IC3.16 J1.3 LBB.5 LBB.6 LBB.7 LBB.8 LBB.9
PHASEC: HCC.1 HCC.2 HCC.3 IC3.19 J1.4 LCC.5 LCC.6 LCC.7 LCC.8 LCC.9
PWMA: IC1.20 IC3.37
PWMB: IC1.19 IC3.39
PWMC: IC1.18 IC3.41
SOA: C1.1 IC3.25 R12.2
SOB: C2.1 IC3.24 R13.2
SOC: IC3.23
SPA: IC3.11 LAA.1 LAA.2 LAA.3 R14.2
SPB: IC3.14 LBB.1 LBB.2 LBB.3 R4.2
SW: C13.2 D1.1 IC3.45 L2.1
SWCLK: IC1.24 U$3.2
SWIO: IC1.23 U$3.3
SWO: IC1.26 U$3.1
VCP: C11.2 IC3.5
VDS: IC3.31 R10.2

Pads without a net: IC1 4 7 8 25 27 28 33; IC2 5 8; IC3 46 48; U$3 NC1 NC2

## Via types
v1: diameter 0.756, hole 0.35, Top Layer to Bottom Layer, 705 vias
v2: diameter 3.607, hole 3.2, Top Layer to Bottom Layer, 4 vias

## Routing (per net, layer and track width the routed paths; a pad name or vN(x,y) marks a point on that pad's centre or on a via; arc(x,y) is an arc through that point)
3.3V: length 136.3
  Top Layer w0.203: IC3.26 42.49,30.05 42.49,29.21 v1(42.65,29.05) ; RPULL4.2 54.93,35.4 ; v1(46.51,12.96) 46.93,12.96 47.78,13.81 IC2.3 50.01,13.81 51.12,14.92 51.12,16.19 52.07,17.14 56.99,17.14 LED3.2 ; 53.85,28.76 U$3.5 ; IC3.33 44.71,32.78 v1(45.56,32.78) ; 50.16,24.19 50.32,24.19 ; 50.32,24.19 C26.1 ; 50.32,24.19 50.22,24.08 49.85,23.71 48.09,23.71 47.95,23.56 IC1.1 ; IC1.17 43.66,17.56 43.66,17.14 45.09,15.72 45.09,13.33 44.69,12.94 43.2,12.94 v1(42.33,13.81) 42.33,12.22 C4.2 42.49,11.01 42.86,10.64 46.97,10.64 P1.2 ; RPULL3.2 54.93,44.27
  Top Layer w0.305: 50.67,24.53 50.22,24.08 ; R1.2 41.85,42.28 v1(41.91,42.23) ; 45.98,28.2 45.98,28 46.04,27.94 ; 45.98,28.2 45.98,28.26 ; 45.98,28.2 45.72,27.94 ; 45.56,27.94 45.66,27.94 45.98,28.26 ; 45.98,28.26 46.3,27.94 46.35,27.94 ; 45.98,28.26 RPULL.2 ; 50.64,41.27 L2.2 v1(48.9,41.89)
  Top Layer w0.406: 50.48,27.94 51.31,28.76 U$3.5 53.5,29.05 57.15,32.7 59.06,32.7 59.7,33.34 LED1.2 59.7,34.44 58.74,35.4 54.61,35.4 53.66,36.35 53.66,40.48 52.25,41.89 L2.2 51.91,41.89 54.29,44.27 58.26,44.27 58.26,44.12 P2.1 ; 50.48,27.94 43.34,27.94 42.65,28.63 v1(42.65,29.05) ; 50.48,27.94 C26.1
  Top Layer w0.762: C46.1 50.64,39.9 50.64,41.27
  Bottom Layer w0.203: v1(46.51,12.96) 43.18,12.96 v1(42.33,13.81) ; 42.65,29.39 v1(42.65,29.05)
  Bottom Layer w0.305: v1(48.9,41.89) 47.62,43.16 42.84,43.16 v1(41.91,42.23) ; v1(42.65,29.05) 42.65,25.56 v1(40.43,23.34) 40.43,15.72 v1(42.33,13.81) ; v1(45.56,32.78) 45.56,32.31 42.65,29.39
3.3VA: length 7.3
  Top Layer w0.203: FB1.2 C30.1 44.03,15.56 42.39,17.2 42.39,18.67 43.3,19.58 43.71,19.58 IC1.15
24V: length 82.8
  Top Layer w0.203: C10.1 33.18,39.21 ; 35.08,41.01 34.98,41.01
  Top Layer w0.305: 34.98,41.01 33.18,39.21 ; IC3.6 38.34,37.03 ; CIN.1 42.23,40.7 42.23,39.22 IC3.47
  Top Layer w0.406: 38.52,37.21 37.47,38.26 33.84,38.26 C10.1 C12.1 30.13,38.92 29.21,39.85 29.21,43.02 28.42,43.81 13.34,43.81 12.22,42.7 12.22,39.05 J1.1 11.27,38.73 11.27,43.18 12.7,44.61 28.89,44.61 30.48,43.02 35.56,43.02 36.04,43.5 42.97,43.5 CIN1.1 CIN.1
  vias: v1(23.65,42.7) v1(23.65,42.07) v1(23.65,41.43) v1(23.65,40.8) v1(23.65,40.16) v1(23.65,39.53) v1(23.65,38.89) v1(23.65,24.45) v1(23.65,23.81) v1(23.65,23.18) v1(23.65,22.54) v1(23.65,21.91) v1(23.65,21.27) v1(23.65,20.64) v1(23.65,18.26) v1(23.65,17.62) v1(23.65,16.99) v1(23.65,16.35) v1(23.65,15.72) v1(23.65,15.08) v1(23.65,14.45) v1(24.29,42.7) v1(24.29,42.07) v1(24.29,41.43) v1(24.29,40.8) v1(24.29,40.16) v1(24.29,39.53) v1(24.29,38.89) v1(24.29,24.45) v1(24.29,23.81) v1(24.29,23.18) v1(24.29,22.54) v1(24.29,21.91) v1(24.29,21.27) v1(24.29,20.64) v1(24.29,18.26) v1(24.29,17.62) v1(24.29,16.99) v1(24.29,16.35) v1(24.29,15.72) v1(24.29,15.08) v1(24.29,14.45) v1(24.92,42.7) v1(24.92,42.07) v1(24.92,41.43) v1(24.92,40.8) v1(24.92,40.16) v1(24.92,39.53) v1(24.92,38.89) v1(24.92,24.45) v1(24.92,23.81) v1(24.92,23.18) v1(24.92,22.54) v1(24.92,21.91) v1(24.92,21.27) v1(24.92,20.64) v1(24.92,18.26) v1(24.92,17.62) v1(24.92,16.99) v1(24.92,16.35) v1(24.92,15.72) v1(24.92,15.08) v1(24.92,14.45) v1(25.56,42.7) v1(25.56,42.07) v1(25.56,41.43) v1(25.56,40.8) v1(25.56,40.16) v1(25.56,39.53) v1(25.56,38.89) v1(25.56,24.45) v1(25.56,23.81) v1(25.56,23.18) v1(25.56,22.54) v1(25.56,21.91) v1(25.56,21.27) v1(25.56,20.64) v1(25.56,18.26) v1(25.56,17.62) v1(25.56,16.99) v1(25.56,16.35) v1(25.56,15.72) v1(25.56,15.08) v1(25.56,14.45) v1(26.19,42.7) v1(26.19,42.07) v1(26.19,41.43) v1(26.19,40.8) v1(26.19,40.16) v1(26.19,39.53) v1(26.19,38.89) v1(26.19,24.45) v1(26.19,23.81) v1(26.19,23.18) v1(26.19,22.54) v1(26.19,21.91) v1(26.19,21.27) v1(26.19,20.64) v1(26.19,18.26) v1(26.19,17.62) v1(26.19,16.99) v1(26.19,16.35) v1(26.19,15.72) v1(26.19,15.08) v1(26.19,14.45) v1(26.83,42.7) v1(26.83,42.07) v1(26.83,41.43) v1(26.83,40.8) v1(26.83,40.16) v1(26.83,39.53) v1(26.83,38.89) v1(26.83,24.45) v1(26.83,23.81) v1(26.83,23.18) v1(26.83,22.54) v1(26.83,21.91) v1(26.83,21.27) v1(26.83,20.64) v1(26.83,18.26) v1(26.83,17.62) v1(26.83,16.99) v1(26.83,16.35) v1(26.83,15.72) v1(26.83,15.08) v1(26.83,14.45) v1(27.46,42.7) v1(27.46,42.07) v1(27.46,41.43) v1(27.46,40.8) v1(27.46,40.16) v1(27.46,39.53) v1(27.46,38.89) v1(27.46,24.45) v1(27.46,23.81) v1(27.46,23.18) v1(27.46,22.54) v1(27.46,21.91) v1(27.46,21.27) v1(27.46,20.64) v1(27.46,18.26) v1(27.46,17.62) v1(27.46,16.99) v1(27.46,16.35) v1(27.46,15.72) v1(27.46,15.08) v1(27.46,14.45) v1(28.1,42.7) v1(28.1,42.07) v1(28.1,41.43) v1(28.1,40.8) v1(28.1,40.16) v1(28.1,39.53) v1(28.1,38.89) v1(28.1,24.45) v1(28.1,23.81) v1(28.1,23.18) v1(28.1,22.54) v1(28.1,21.91) v1(28.1,21.27) v1(28.1,20.64) v1(28.1,18.26) v1(28.1,17.62) v1(28.1,16.99) v1(28.1,16.35) v1(28.1,15.72) v1(28.1,15.08) v1(28.1,14.45)
AGND: length 6.4
  Top Layer w0.203: 42.17,15.4 C30.2 41.91,15.66 41.91,18.89 43.06,20.05 IC1.14
DVDD: length 2.6
  Top Layer w0.203: IC3.36 46.34,34.27 C14.1
GND: length 143.5
  Top Layer w0.203: v1(46.51,14.66) 46.93,15.08 IC2.2 ; IC1.31 IC1.32 ; IC1.32 48.65,22.49 ; IC1.32 48.65,22.54 v1(49.53,22.54) 50.43,22.54 C26.2 ; IC3.27 44.2,29.05 v1(44.35,29.05) ; 48.18,34.53 48.18,34.85 ; 48.18,34.53 48.02,34.69 ; 48.18,34.53 48.61,34.1 R3.1 48.7,34.41 v1(49.21,34.92) ; 48.18,34.53 47.86,34.53 ; 48.18,34.85 48.02,34.69 ; 48.18,34.85 49.05,35.72 49.05,36.29 C14.2 ; 44.99,33.92 45.41,33.5 46.83,33.5 47.86,34.53 ; 52.07,36.41 50.48,36.41 50.53,36.46 50.9,36.83 R6.1 50.9,38.46 v1(52.28,39.85) ; 48.02,34.69 47.86,34.53 ; C4.1 44.19,11.59 44.66,11.11 48.5,11.11 P1.1 52.62,6.98 58.9,6.98 59.53,7.62 59.53,12.22 58.21,13.55 R11.1 ; 53.12,27.15 v1(53.5,26.76) ; IC1.16 43.02,18.32 v1(43.02,18.26) ; v1(49.05,27.15) 48.1,26.19 XT1.2
  Top Layer w0.305: C14.2 50.36,36.64 50.53,36.46 ; D1.2 46.76,44.45 v1(45.4,44.45) ; 45.09,38.79 v1(45.09,38.73) 44.57,38.73 IC3.43 ; 44.98,44.23 v1(44.77,44.45)
  Top Layer w0.406: v1(39.05,44.45) 38.97,44.53 R8.1 ; v1(44.98,41.75) CIN1.2 44.98,44.23
  Bottom Layer w0.203: v1(49.05,27.15) 49.53,26.67 v1(49.53,22.54) ; v1(40,25.18) 40,28.57 46.04,34.61 46.04,37.78 v1(45.09,38.73) ; v1(43.81,25.18) 43.81,28.52 v1(44.35,29.05) ; v1(53.5,26.76) 53.5,32.4 P2.4 ; P1.1 51.2,9.98 v1(46.51,14.66)
  Bottom Layer w0.305: v1(52.28,39.85) 52.28,41.85 49.69,44.45 ; P2.4 59.23,37.64 60.64,39.05 60.64,44.29 59.69,45.24 50.48,45.24 49.69,44.45 ; 49.69,44.45 v1(45.4,44.45)
  Bottom Layer w0.406: v1(44.98,41.75) 45.09,41.65 v1(45.09,38.73)
  vias: v1(39.05,45.08) v1(39.37,42.28) v1(39.69,45.08) v1(39.69,44.45) v1(40.32,45.08) v1(40.32,44.45) v1(40.96,45.08) v1(40.96,44.45) v1(41.59,45.08) v1(41.59,44.45) v1(42.23,45.08) v1(42.23,44.45) v1(42.86,45.08) v1(42.86,44.45) v1(43.5,45.08) v1(43.5,44.45) v1(44.13,45.08) v1(44.13,44.45) v1(44.77,45.08) v1(45.4,45.08)
BAT-: length 105.3
  Top Layer w0.203: IC3.12 36.26,35.58 33.99,35.58 33.54,35.13 R14.1 ; IC3.21 39.51,31.33 ; 39.51,31.33 39.05,30.88 39.05,30.64 ; 39.51,31.33 IC3.22 39.5,31.09 39.05,30.64 ; 39.05,30.64 39.05,24.45 39.53,23.97 39.53,12.54 37.15,10.16 27.78,10.16 v1(27.78,9.84) ; R4.1 33.54,29.57 35.24,31.27 35.24,32.94 IC3.13
  Top Layer w0.305: IC3.2 40.96,37.95 v1(40.96,37.78) v1(40.96,34.77) ; C12.2 30.45,42.07 v1(30.32,42.07)
  Top Layer w0.406: R8.2 30.19,44.53 29.31,45.4 12.06,45.4 9.05,42.39 9.05,14.45 10.48,13.02 J1.5
  vias: v1(10.64,11.11) v1(10.64,10.48) v1(10.64,9.84) v1(10.64,9.21) v1(10.64,8.57) v1(10.64,7.94) v1(10.64,7.3) v1(10.64,6.67) v1(10.64,6.03) v1(11.27,11.11) v1(11.27,10.48) v1(11.27,9.84) v1(11.27,9.21) v1(11.27,8.57) v1(11.27,7.94) v1(11.27,7.3) v1(11.27,6.67) v1(11.27,6.03) v1(11.91,11.11) v1(11.91,10.48) v1(11.91,9.84) v1(11.91,9.21) v1(11.91,8.57) v1(11.91,7.94) v1(11.91,7.3) v1(11.91,6.67) v1(11.91,6.03) v1(12.54,11.11) v1(12.54,10.48) v1(12.54,9.84) v1(12.54,9.21) v1(12.54,8.57) v1(12.54,7.94) v1(12.54,7.3) v1(12.54,6.67) v1(12.54,6.03) v1(13.18,7.3) v1(13.18,6.67) v1(13.18,6.03) v1(13.81,7.3) v1(13.81,6.67) v1(13.81,6.03) v1(14.45,7.3) v1(14.45,6.67) v1(14.45,6.03) v1(15.08,7.3) v1(15.08,6.67) v1(15.08,6.03) v1(15.72,7.3) v1(15.72,6.67) v1(15.72,6.03) v1(16.35,7.3) v1(16.35,6.67) v1(16.35,6.03) v1(16.99,7.3) v1(16.99,6.67) v1(16.99,6.03) v1(17.62,7.3) v1(17.62,6.67) v1(17.62,6.03) v1(18.26,7.3) v1(18.26,6.67) v1(18.26,6.03) v1(18.89,7.3) v1(18.89,6.67) v1(18.89,6.03) v1(19.53,7.3) v1(19.53,6.67) v1(19.53,6.03) v1(20.16,7.3) v1(20.16,6.67) v1(20.16,6.03) v1(20.8,7.3) v1(20.8,6.67) v1(20.8,6.03) v1(21.43,7.3) v1(21.43,6.67) v1(21.43,6.03) v1(22.07,7.3) v1(22.07,6.67) v1(22.07,6.03) v1(22.7,7.3) v1(22.7,6.67) v1(22.7,6.03) v1(23.34,7.3) v1(23.34,6.67) v1(23.34,6.03) v1(23.97,7.3) v1(23.97,6.67) v1(23.97,6.03) v1(24.61,11.11) v1(24.61,10.48) v1(24.61,9.84) v1(24.61,9.21) v1(24.61,8.57) v1(24.61,7.94) v1(24.61,7.3) v1(24.61,6.67) v1(24.61,6.03) v1(25.24,11.11) v1(25.24,10.48) v1(25.24,9.84) v1(25.24,9.21) v1(25.24,8.57) v1(25.24,7.94) v1(25.24,7.3) v1(25.24,6.67) v1(25.24,6.03) v1(25.88,11.11) v1(25.88,10.48) v1(25.88,9.84) v1(25.88,9.21) v1(25.88,8.57) v1(25.88,7.94) v1(25.88,7.3) v1(25.88,6.67) v1(25.88,6.03) v1(26.51,11.11) v1(26.51,10.48) v1(26.51,9.84) v1(26.51,9.21) v1(26.51,8.57) v1(26.51,7.94) v1(26.51,7.3) v1(26.51,6.67) v1(26.51,6.03) v1(27.15,10.48) v1(27.15,9.84) v1(27.15,9.21) v1(27.15,8.57) v1(27.15,7.94) v1(27.15,7.3) v1(27.15,6.67) v1(27.15,6.03) v1(27.78,9.21) v1(27.78,8.57) v1(27.78,7.94) v1(27.78,7.3) v1(27.78,6.67) v1(27.78,6.03) v1(28.42,9.84) v1(28.42,9.21) v1(28.42,8.57) v1(28.42,7.94) v1(28.42,7.3) v1(28.42,6.67) v1(28.42,6.03) v1(29.05,9.84) v1(29.05,9.21) v1(29.05,8.57) v1(29.05,7.94) v1(29.05,7.3) v1(29.05,6.67) v1(29.05,6.03) v1(29.53,35.4) v1(29.53,34.77) v1(29.53,34.13) v1(29.53,33.5) v1(29.53,32.86) v1(29.53,32.23) v1(29.53,30.16) v1(29.53,29.53) v1(29.53,28.89) v1(29.53,28.26) v1(29.53,27.62) v1(29.53,26.99) v1(29.69,9.84) v1(29.69,9.21) v1(29.69,8.57) v1(29.69,7.94) v1(29.69,7.3) v1(29.69,6.67) v1(29.69,6.03) v1(30.16,35.4) v1(30.16,34.77) v1(30.16,34.13) v1(30.16,33.5) v1(30.16,32.86) v1(30.16,32.23) v1(30.16,30.16) v1(30.16,29.53) v1(30.16,28.89) v1(30.16,28.26) v1(30.16,27.62) v1(30.16,26.99) v1(30.32,41.27) v1(30.32,9.84) v1(30.32,9.21) v1(30.32,8.57) v1(30.32,7.94) v1(30.32,7.3) v1(30.32,6.67) v1(30.32,6.03) v1(30.8,35.4) v1(30.8,34.77) v1(30.8,34.13) v1(30.8,33.5) v1(30.8,32.86) v1(30.8,32.23) v1(30.8,30.16) v1(30.8,29.53) v1(30.8,28.89) v1(30.8,28.26) v1(30.8,27.62) v1(30.8,26.99) v1(30.96,9.84) v1(30.96,9.21) v1(30.96,8.57) v1(30.96,7.94) v1(30.96,7.3) v1(30.96,6.67) v1(30.96,6.03) v1(31.27,42.07) v1(31.27,41.27) v1(31.43,35.4) v1(31.43,34.77) v1(31.43,34.13) v1(31.43,33.5) v1(31.43,32.86) v1(31.43,32.23) v1(31.43,30.16) v1(31.43,29.53) v1(31.43,28.89) v1(31.43,28.26) v1(31.43,27.62) v1(31.43,26.99) v1(31.59,9.84) v1(31.59,9.21) v1(31.59,8.57) v1(31.59,7.94) v1(31.59,7.3) v1(31.59,6.67) v1(31.59,6.03) v1(32.07,35.4) v1(32.07,34.77) v1(32.07,34.13) v1(32.07,33.5) v1(32.07,32.86) v1(32.07,32.23) v1(32.07,30.16) v1(32.07,29.53) v1(32.07,28.89) v1(32.07,28.26) v1(32.07,27.62) v1(32.07,26.99) v1(32.23,9.84) v1(32.23,9.21) v1(32.23,8.57) v1(32.23,7.94) v1(32.23,7.3) v1(32.23,6.67) v1(32.23,6.03) v1(32.7,42.07) v1(32.7,41.27) v1(32.7,35.4) v1(32.7,34.77) v1(32.7,34.13) v1(32.7,33.5) v1(32.7,32.86) v1(32.7,32.23) v1(32.7,30.16) v1(32.7,29.53) v1(32.7,28.89) v1(32.7,28.26) v1(32.7,27.62) v1(32.7,26.99) v1(32.86,9.84) v1(32.86,9.21) v1(32.86,8.57) v1(32.86,7.94) v1(32.86,7.3) v1(32.86,6.67) v1(32.86,6.03) v1(33.34,35.4) v1(33.34,34.77) v1(33.34,34.13) v1(33.34,33.5) v1(33.34,32.86) v1(33.34,32.23) v1(33.34,30.16) v1(33.34,29.53) v1(33.34,28.89) v1(33.34,28.26) v1(33.34,27.62) v1(33.34,26.99) v1(33.5,9.84) v1(33.5,9.21) v1(33.5,8.57) v1(33.5,7.94) v1(33.5,7.3) v1(33.5,6.67) v1(33.5,6.03) v1(33.66,42.07) v1(33.66,41.27) v1(33.97,35.4) v1(33.97,34.77) v1(33.97,34.13) v1(33.97,33.5) v1(33.97,32.86) v1(33.97,32.23) v1(33.97,30.16) v1(33.97,29.53) v1(33.97,28.89) v1(33.97,28.26) v1(33.97,27.62) v1(33.97,26.99) v1(34.13,9.84) v1(34.13,9.21) v1(34.13,8.57) v1(34.13,7.94) v1(34.13,7.3) v1(34.13,6.67) v1(34.13,6.03) v1(34.29,22.86) v1(34.29,22.22) v1(34.29,21.59) v1(34.29,15.08) v1(34.29,14.45) v1(34.29,13.81) v1(34.77,9.84) v1(34.77,9.21) v1(34.77,8.57) v1(34.77,7.94) v1(34.77,7.3) v1(34.77,6.67) v1(34.77,6.03) v1(34.93,22.86) v1(34.93,22.22) v1(34.93,21.59) v1(34.93,15.08) v1(34.93,14.45) v1(34.93,13.81) v1(35.4,9.84) v1(35.4,9.21) v1(35.4,8.57) v1(35.4,7.94) v1(35.4,7.3) v1(35.4,6.67) v1(35.4,6.03) v1(35.56,22.86) v1(35.56,22.22) v1(35.56,21.59) v1(35.56,15.08) v1(35.56,14.45) v1(35.56,13.81) v1(36.19,22.86) v1(36.19,22.22) v1(36.19,21.59) v1(36.19,15.08) v1(36.19,14.45) v1(36.19,13.81) v1(36.83,22.86) v1(36.83,22.22) v1(36.83,21.59) v1(36.83,15.08) v1(36.83,14.45) v1(36.83,13.81) v1(37.94,34.77) v1(38.42,35.24) v1(38.42,34.29) v1(38.89,35.72) v1(38.89,34.77) v1(38.89,33.81) v1(39.45,36.27) v1(39.37,35.24) v1(39.37,34.29) v1(39.45,33.26) v1(39.85,34.77) v1(39.93,35.8) v1(39.93,33.73) v1(40,36.83) v1(40,32.7) v1(40.4,35.32) v1(40.4,34.21) v1(40.48,37.31) v1(40.48,36.35) v1(40.48,33.18) v1(40.48,32.23) v1(40.96,36.83) v1(40.96,35.88) v1(40.96,33.65) v1(40.96,32.7) v1(40.96,31.75) v1(41.43,37.31) v1(41.43,36.35) v1(41.43,33.18) v1(41.43,32.23) v1(41.51,35.32) v1(41.51,34.21) v1(41.91,36.83) v1(41.91,32.7) v1(41.99,35.8) v1(41.99,33.73) v1(42.07,34.77) v1(42.47,36.27) v1(42.54,35.24) v1(42.54,34.29) v1(42.47,33.26) v1(43.02,35.72) v1(43.02,34.77) v1(43.02,33.81) v1(43.5,35.24) v1(43.5,34.29) v1(43.97,34.77)
CANH: length 9.1
  Top Layer w0.406: IC2.7 54.93,15.08 57.52,12.48 R5.1 58.15,11.6 P3.1
CANL: length 6.9
  Top Layer w0.406: P3.2 56.15,11.9 R5.2 55.82,12.76 54.77,13.81 IC2.6
CB: length 3
  Top Layer w0.305: IC3.44 44.98,39.85 C13.1
CLK_MAG: length 17.4
  Top Layer w0.203: IC1.10 43.73,22.07 41.59,22.07 40.48,20.95 40.48,11.13 P1.5
CPH: length 3.3
  Top Layer w0.305: 39.4,38.09 37.32,40.17 C45.2
CPL: length 5
  Top Layer w0.305: IC3.3 38.26,39.94 38.26,41.11 37.31,42.07 C45.1
CS_MAG: length 18.3
  Top Layer w0.203: P1.6 40,9.6 40,21.11 41.43,22.54 42.07,22.54 ; 42.07,22.54 42.91,22.54 42.91,22.55 IC1.9 ; 42.07,22.54 42.12,22.6 RPULL2.2
ENABLE: length 47.3
  Top Layer w0.203: 47.47,40 47.62,40.16 ; 47.47,40 47.62,40 ; 47.47,40 47.31,40 ; 47.62,40.16 v1(47.62,40.48) ; 47.62,40.16 47.78,40 ; 47.62,40.16 47.62,40 ; 47.62,39.69 47.62,38.89 45.72,36.99 44.95,36.99 IC3.40 ; 47.62,39.69 47.62,39.85 47.78,40 ; 47.62,39.69 47.94,40 ; 47.62,39.69 47.31,40 ; 47.94,40 48.74,40 49.21,39.53 49.21,38.89 48.74,38.42 48.42,38.42 46.04,36.04 45.41,36.04 IC3.38 ; 47.94,40 47.78,40 ; 47.31,40 46.51,40 46.04,39.53 46.04,38.58 45.4,37.94 44.49,37.94 IC3.42 ; 47.62,40 47.78,40 ; IC1.13 42.45,20.55 v1(42.23,20.32)
  Bottom Layer w0.203: v1(47.62,40.48) 46.99,40.48 46.04,39.53 46.04,38.73 46.83,37.94 46.83,26.51 44.77,24.45 44.77,21.11 43.97,20.32 v1(42.23,20.32)
ENC_A: length 28.2
  Top Layer w0.203: v1(50.8,21.11) 50.37,21.55 IC1.30 ; RPULL4.1 58.05,38.95 P2.3
  Bottom Layer w0.305: v1(50.8,21.11) 51.59,21.91 51.59,32.5 P2.3
ENC_B: length 29.9
  Top Layer w0.203: v1(49.85,20.8) 49.6,21.05 IC1.29 ; P2.2 58,40.9 RPULL3.1
  Bottom Layer w0.305: P2.2 50.96,33.86 50.96,22.54 49.85,21.43 v1(49.85,20.8)
FB: length 4.1
  Top Layer w0.305: R2.2 39.43,40.64 39.85,40.64 ; 40.48,40.64 40.16,40.64 ; 40.48,40.64 40.9,40.64 R1.1 ; 40.48,40.64 40.16,40.32 ; 40.16,40.64 39.85,40.64 ; 40.16,40.64 40.16,40.32 ; 40.16,40.32 40.16,39.45 IC3.1 ; 40.16,40.32 39.85,40.64
FDCAN_RX: length 11
  Top Layer w0.203: IC1.21 46.45,17.69 47.15,16.99 47.15,16.03 46.83,15.72 46.04,15.72 45.56,15.24 45.56,12.38 46.04,11.91 47.62,11.91 48.26,12.54 ; 47.93,12.54 48.26,12.54 ; 48.26,12.54 IC2.4
FDCAN_TX: length 2.6
  Top Layer w0.203: IC2.1 46.95,17.81 IC1.22
GAIN: length 4.2
  Top Layer w0.203: IC3.32 44.72,32.07 46.67,32.07 R3.2
GHA: length 17
  Top Layer w0.203: HAA.4 22.83,37.94 26.03,37.94 26.35,37.62 37.04,37.62 IC3.8
GHB: length 29.7
  Top Layer w0.203: HBB.4 23.15,19.37 36.67,19.37 37.62,20.32 37.62,23.34 37.15,23.81 37.15,32.02 IC3.17
GHC: length 37.7
  Top Layer w0.203: 38.34,32.5 37.62,31.79 37.62,23.97 38.1,23.49 38.1,13.49 36.19,11.59 28.89,11.59 26.83,13.65 22.67,13.65 HCC.4
GLA: length 12.7
  Top Layer w0.203: LAA.4 24.87,36.67 36.58,36.67 IC3.10
GLB: length 22.9
  Top Layer w0.203: v1(35.88,34.77) 34.77,33.65 34.77,31.59 34.13,30.96 25.56,30.96 25.26,30.66 LBB.4 ; 37.26,33.56 IC3.15 36.19,32.48 36.19,30.32 v1(35.88,30)
  Bottom Layer w0.203: v1(35.88,34.77) v1(35.88,30)
GLC: length 35.2
  Top Layer w0.203: IC3.20 38.58,31.32 38.58,24.29 39.05,23.81 39.05,12.86 36.83,10.64 28.26,10.64 26.49,12.4 LCC.4
IDRIVE: length 10.8
  Top Layer w0.203: IC3.30 44.25,31.11 47.62,31.11 50.32,33.81 51.17,33.81 R7.2
LEDFAULT: length 8.4
  Top Layer w0.203: RPULL1.2 51.44,32.7 52.55,32.7 53.97,34.13 LED1.1
LP_SOA: length 2.2
  Top Layer w0.254: IC1.5 45.95,24.48 R12.1
LP_SOB: length 5.2
  Top Layer w0.254: IC1.6 45.45,23.93 45.24,24.13 43.02,24.13 41.97,25.18 R13.1
MISO_MAG: length 18
  Top Layer w0.203: P1.4 43.93,9.68 42.54,9.68 40.96,11.27 40.96,20.8 41.71,21.55 IC1.11
MODE: length 16.3
  Top Layer w0.203: IC3.29 44.02,30.64 47.78,30.64 50.48,33.34 52.39,33.34 53.02,33.97 53.02,37.68 R6.2
MOSI_MAG: length 18.7
  Top Layer w0.203: P1.3 45.45,10.16 42.7,10.16 41.43,11.43 41.43,20.64 41.84,21.05 IC1.12
N$1:
  vias: v2(2.54,48.74)
N$2:
  vias: v2(2.54,2.54)
N$3:
  vias: v2(59.53,2.54)
N$4:
  vias: v2(59.53,48.74)
N$9: length 2.2
  Top Layer w0.203: XT1.3 46.95,25.35 IC1.3
N$10: length 2.2
  Top Layer w0.203: LED3.1 59.91,15.82 R11.2
N$11: length 3.6
  Top Layer w0.203: IC1.2 47.45,23.79 47.78,24.13 48.9,24.13 49.3,24.54 XT1.1
NFAULT: length 9.9
  Top Layer w0.203: RPULL.1 47.78,29.05 48.58,29.84 ; 48.58,30 48.58,30.16 ; 48.58,30 48.42,30.16 ; 48.58,30 48.58,29.84 ; 48.58,30.16 48.9,30.16 ; 48.58,30.16 48.42,30.16 ; RPULL1.1 48.9,30.16 ; 48.9,30.16 48.58,29.84 ; 48.42,30.16 43.79,30.16 42.51,31.44
PHASEA: length 18.6
  Top Layer w0.203: IC3.9 36.81,37.15 26.19,37.15 25.88,37.46 22.7,37.46 21.56,36.32 LAA.9
PHASEB: length 25.2
  Top Layer w0.203: IC3.16 36.67,32.25 36.67,27.3 34.77,25.4 20.56,25.4 LBB.8
PHASEC: length 39.6
  Top Layer w0.203: IC3.19 38.1,31.55 38.1,24.13 38.58,23.65 38.58,13.18 36.51,11.11 28.57,11.11 26.51,13.18 23.65,13.18 21.56,11.08 LCC.9
PWMA: length 31
  Top Layer w0.203: IC3.37 45.64,35.56 46.2,35.56 48.58,37.94 49.37,37.94 v1(49.69,38.26) ; IC1.20 45.95,17.08 v1(46.51,16.51)
  Bottom Layer w0.203: v1(49.69,38.26) 48.26,36.83 48.26,25.56 46.2,23.49 46.2,16.83 v1(46.51,16.51)
PWMB: length 31
  Top Layer w0.203: IC1.19 45.45,16.55 v1(45.4,16.51) ; v1(48.42,39.21) 48.42,39.05 45.88,36.51 45.18,36.51 IC3.39
  Bottom Layer w0.203: v1(45.4,16.51) 45.72,16.83 45.72,23.81 47.78,25.88 47.78,38.58 v1(48.42,39.21)
PWMC: length 28.6
  Top Layer w0.203: v1(46.83,39.21) 46.83,38.73 45.56,37.46 44.72,37.46 IC3.41 ; v1(44.61,17.3) 44.95,17.64 IC1.18
  Bottom Layer w0.203: v1(44.61,17.3) 45.24,17.94 45.24,24.13 47.31,26.19 47.31,38.73 v1(46.83,39.21)
SOA: length 6.8
  Top Layer w0.305: R12.2 C1.1 43.12,26.88 40.82,29.19 40.82,29.75 IC3.25
SOB: length 5.1
  Top Layer w0.305: IC3.24 40,29.92 C2.1 R13.2
SPA: length 11
  Top Layer w0.203: R14.2 27.74,35.04 28.89,36.19 36.35,36.19 36.93,35.61
  vias: v1(24.61,35.4) v1(24.61,34.77) v1(24.61,34.13) v1(24.61,33.5) v1(24.61,32.86) v1(24.61,32.23) v1(25.24,35.4) v1(25.24,34.77) v1(25.24,34.13) v1(25.24,33.5) v1(25.24,32.86) v1(25.24,32.23) v1(25.88,35.4) v1(25.88,34.77) v1(25.88,34.13) v1(25.88,33.5) v1(25.88,32.86) v1(25.88,32.23) v1(26.83,35.4) v1(26.83,34.77) v1(26.83,34.13) v1(26.83,33.5) v1(26.83,32.86) v1(26.83,32.23) v1(27.46,35.4) v1(27.46,34.77) v1(27.46,34.13) v1(27.46,33.5) v1(27.46,32.86) v1(27.46,32.23) v1(28.1,35.4) v1(28.1,34.77) v1(28.1,34.13) v1(28.1,33.5) v1(28.1,32.86) v1(28.1,32.23)
SPB: length 15.1
  Top Layer w0.203: v1(28.1,26.19) 34.45,26.19 34.93,26.67 34.93,30.16 35.72,30.96 35.72,32.71 36.93,33.92
  vias: v1(24.61,29.37) v1(24.61,28.73) v1(24.61,28.1) v1(24.61,27.46) v1(24.61,26.83) v1(24.61,26.19) v1(25.24,29.37) v1(25.24,28.73) v1(25.24,28.1) v1(25.24,27.46) v1(25.24,26.83) v1(25.24,26.19) v1(25.88,29.37) v1(25.88,28.73) v1(25.88,28.1) v1(25.88,27.46) v1(25.88,26.83) v1(25.88,26.19) v1(26.83,30) v1(26.83,29.37) v1(26.83,28.73) v1(26.83,28.1) v1(26.83,27.46) v1(26.83,26.83) v1(26.83,26.19) v1(27.46,30) v1(27.46,29.37) v1(27.46,28.73) v1(27.46,28.1) v1(27.46,27.46) v1(27.46,26.83) v1(27.46,26.19) v1(28.1,30) v1(28.1,29.37) v1(28.1,28.73) v1(28.1,28.1) v1(28.1,27.46) v1(28.1,26.83)
SW: length 12.2
  Top Layer w0.305: 42.51,38.09 43.28,38.86 C13.2 43.28,40.42 43.66,40.8 46.11,40.8 D1.1 47.15,42.54 49.39,44.79 L2.1
SWCLK: length 13.2
  Top Layer w0.203: IC1.24 48.04,18.26 49.05,18.26 50.48,19.68 55.56,19.68 55.88,20 55.88,21.75 54.86,22.76 U$3.2
SWIO: length 17.5
  Top Layer w0.203: U$3.3 54.93,24.76 56.36,23.34 56.36,19.68 55.88,19.21 50.8,19.21 49.21,17.62 47.62,17.62 47.47,17.78 47.47,18.33 IC1.23
SWO: length 5.4
  Top Layer w0.203: U$3.1 52.07,20.76 51.47,20.16 50.16,20.16 49.55,19.55 IC1.26
VCP: length 4.6
  Top Layer w0.305: IC3.5 37.79,39 35.4,39 C11.2
VDS: length 8.6
  Top Layer w0.203: IC3.31 44.49,31.59 47.47,31.59 50.48,34.61 R10.2

## Copper pours and planes (outline as drawn; the poured copper is in the pictures)
24V on Top Layer: 23.34,24.76 23.34,20 32.07,20 32.07,24.76
24V on Top Layer: 23.34,18.89 23.34,14.13 32.07,14.13 32.07,18.89
24V on Bottom Layer: 5.4,43.02 28.42,43.02 28.42,36.35 23.65,36.35 23.65,25.24 28.42,25.24 28.42,14.13 9.37,14.13 9.37,11.59 5.4,11.59
GND on Top Layer: 33.81,45.4 33.81,44.13 45.72,44.13 45.72,45.4
GND on Bottom Layer: 38.74,45.56 38.74,41.43 45.4,34.77 38.74,28.1 38.74,5.71 61.91,5.71 61.91,45.56
BAT- on Top Layer: 31.12,30.48 34.29,30.48 34.29,26.67 31.12,26.67
BAT- on Top Layer: 9.84,12.54 11.75,14.45 12.22,14.45 13.02,13.65 13.02,7.62 24.29,7.62 24.29,11.43 26.67,11.43 27.94,10.16 38.1,10.16 38.1,5.71 9.84,5.71
BAT- on Top Layer: 31.12,35.72 34.29,35.72 34.29,31.91 31.12,31.91
BAT- on Bottom Layer: 0.32,45.72 0.32,5.71 38.1,5.71 38.1,28.42 44.45,34.77 38.1,41.12 38.1,45.72
PHASEA on Top Layer: 22.54,39.85 20.64,39.85 20.64,38.26 23.34,35.56 23.34,32.07 18.73,32.07 17.15,30.48 9.84,30.48 9.84,36.35 12.54,36.35 13.65,37.46 13.65,43.18 22.54,43.18
PHASEB on Top Layer: 23.34,31.43 23.34,25.56 22.54,25.56 22.54,21.59 9.84,21.59 9.84,29.84 17.3,29.84 18.89,31.43
PHASEC on Top Layer: 22.54,19.13 21.51,19.13 19.69,20.95 9.84,20.95 9.84,15.08 12.54,15.08 13.65,13.97 13.65,8.25 23.34,8.25 23.34,10.95 20.64,13.65 20.64,15.4 22.54,15.4
SPA on Top Layer: 24.29,35.72 28.42,35.72 28.42,31.43 24.29,31.43
SPA on Bottom Layer: 24.29,31.43 24.29,35.72 28.42,35.72 28.42,31.43
SPB on Top Layer: 24.29,29.69 24.29,25.88 28.42,25.88 28.42,30.32 26.67,30.32 26.03,29.69
SPB on Bottom Layer: 24.29,29.69 26.03,29.69 26.67,30.32 28.42,30.32 28.42,25.88 24.29,25.88

## Text on the board
Top Silkscreen Layer: CS | CLK | MI | MO | 3V3 | GND | CANL | CANH | FAULT | POWER | B | A | IO | O | VIN | U | V | W
